# EAGLE design DSP_Shield (EAGLE 6.2)
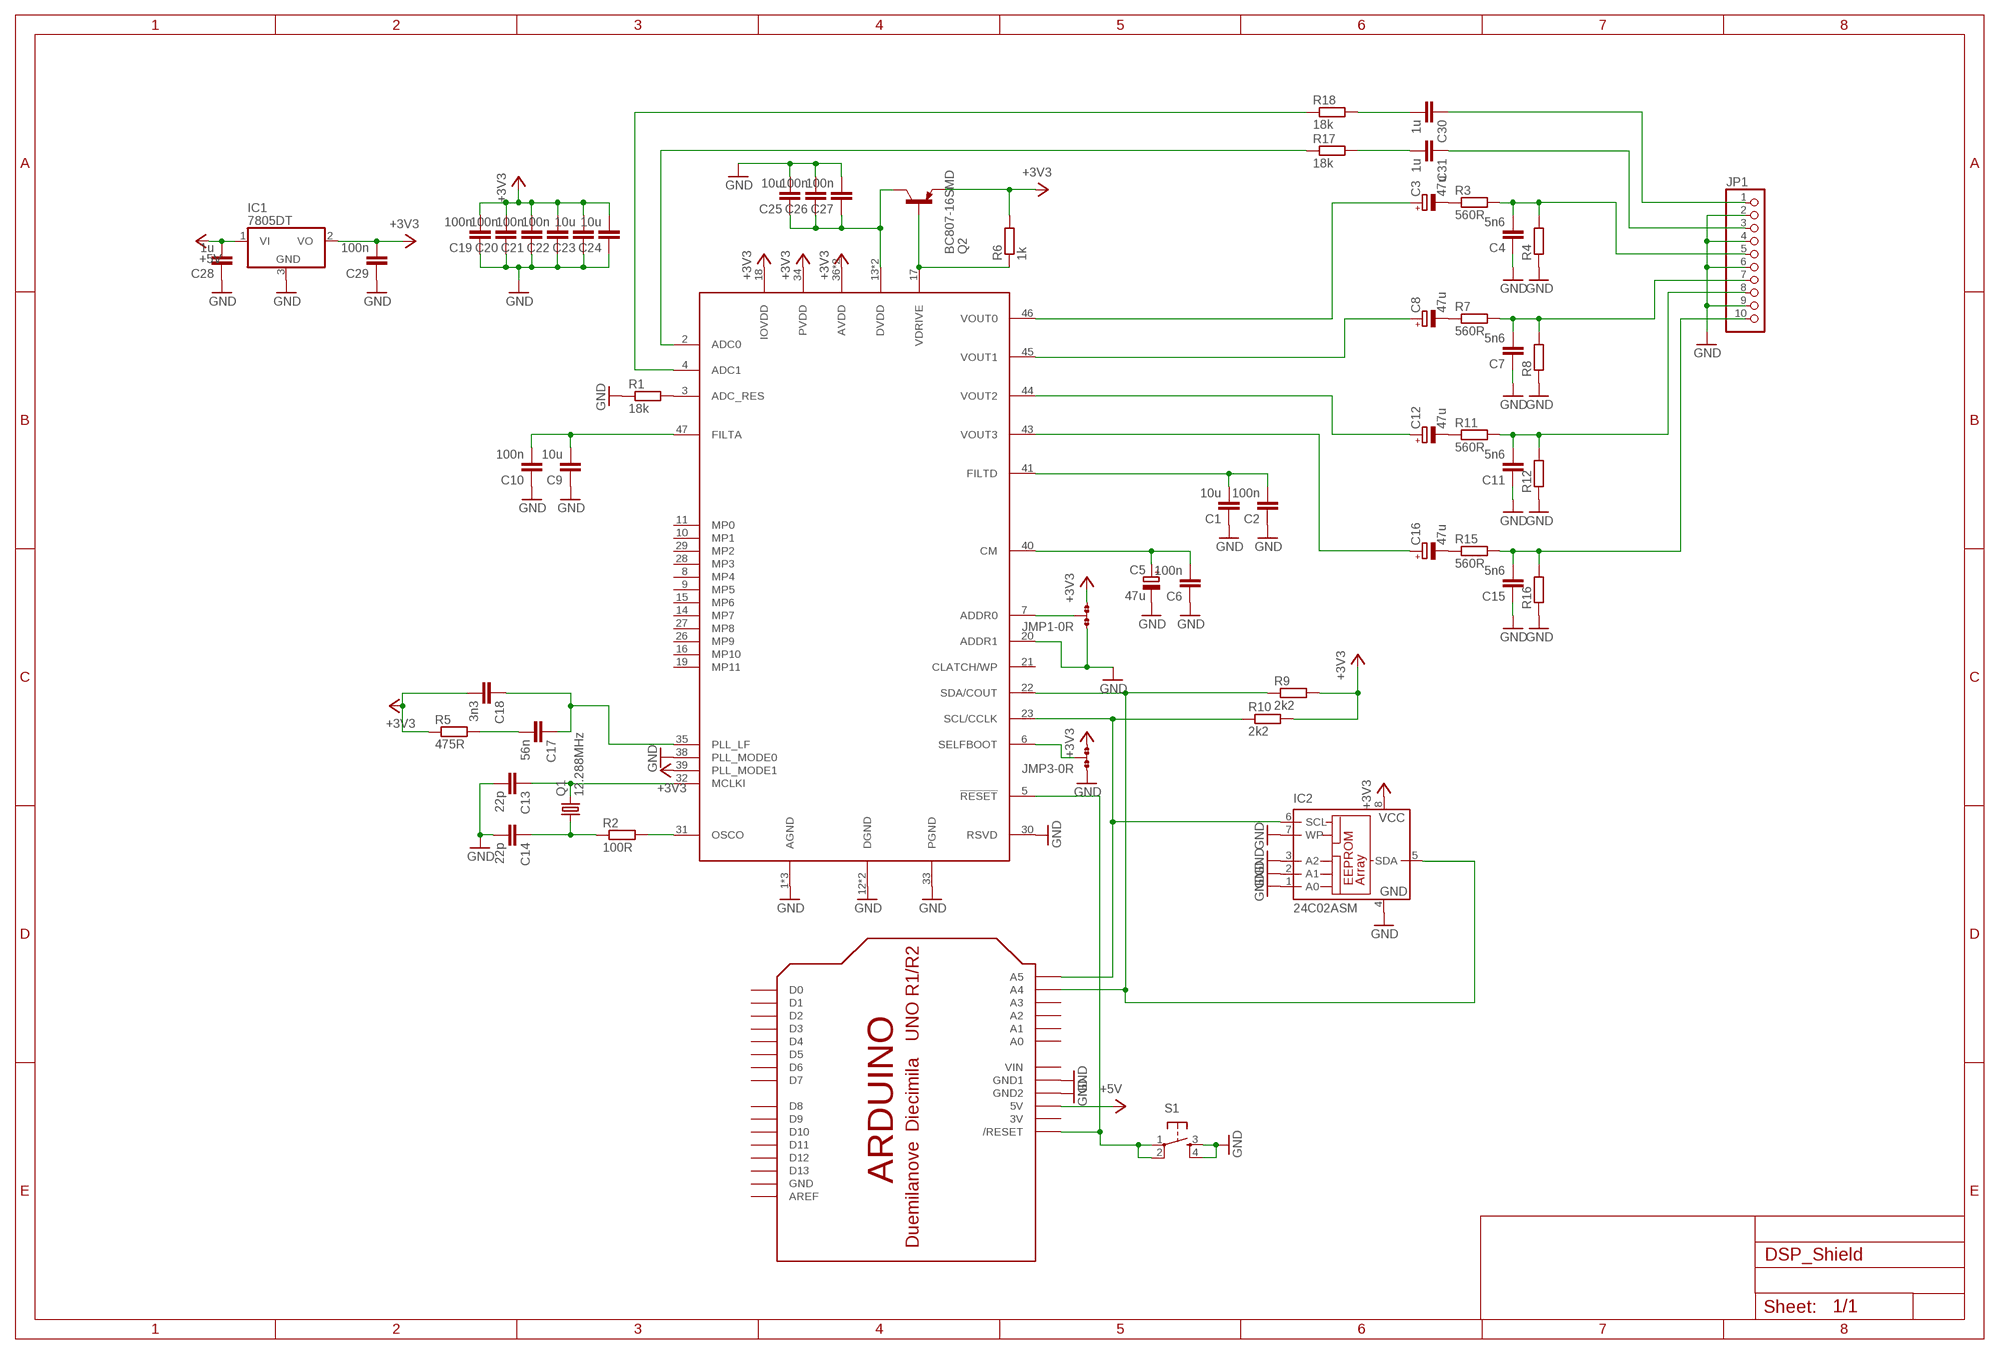
[diagram p0: schematic, sheet 1]

## Parts
C1  10u  C-EUC0805  [C0805]
C2  100n  C-EUC0805  [C0805]
C3  47u  CPOL-EUD  [PANASONIC_D]
C4  5n6  C-EUC0805  [C0805]
C5  47u  CPOL-EUB  [PANASONIC_B]
C6  100n  C-EUC0805  [C0805]
C7  5n6  C-EUC0805  [C0805]
C8  47u  CPOL-EUD  [PANASONIC_D]
C9  10u  C-EUC0805  [C0805]
C10  100n  C-EUC0805  [C0805]
C11  5n6  C-EUC0805  [C0805]
C12  47u  CPOL-EUD  [PANASONIC_D]
C13  22p  C-EUC0805  [C0805]
C14  22p  C-EUC0805  [C0805]
C15  5n6  C-EUC0805  [C0805]
C16  47u  CPOL-EUD  [PANASONIC_D]
C17  56n  C-EUC0805  [C0805]
C18  3n3  C-EUC0805  [C0805]
C19  100n  C-EUC0805  [C0805]
C20  100n  C-EUC0805  [C0805]
C21  100n  C-EUC0805  [C0805]
C22  100n  C-EUC0805  [C0805]
C23  10u  C-EUC0805  [C0805]
C24  10u  C-EUC0805  [C0805]
C25  10u  C-EUC0805  [C0805]
C26  100n  C-EUC0805  [C0805]
C27  100n  C-EUC0805  [C0805]
C28  1u  C-EUC0805  [C0805]
C29  100n  C-EUC0805  [C0805]
C30  1u  C-EUC0805  [C0805]
C31  1u  C-EUC0805  [C0805]
IC1  7805DT  [TO252]
IC2  24C02ASM  [SO-08M]
JMP1  0R-JUMPA  [A0R-JMP]
JMP3  0R-JUMPA  [A0R-JMP]
JP1  PINHD-1X10/90  [1X10/90]
Q1  12.288MHz  CRYSTALHC49UP  [HC49UP]
Q2  BC807-16SMD  [SOT23-BEC]
R1  18k  R-EU_R0805  [R0805]
R2  100R  R-EU_R0805  [R0805]
R3  560R  R-EU_R0805  [R0805]
R4  R-EU_R0805  [R0805]
R5  475R  R-EU_R0805  [R0805]
R6  1k  R-EU_R0805  [R0805]
R7  560R  R-EU_R0805  [R0805]
R8  R-EU_R0805  [R0805]
R9  2k2  R-EU_R0805  [R0805]
R10  2k2  R-EU_R0805  [R0805]
R11  560R  R-EU_R0805  [R0805]
R12  R-EU_R0805  [R0805]
R15  560R  R-EU_R0805  [R0805]
R16  R-EU_R0805  [R0805]
R17  18k  R-EU_R0805  [R0805]
R18  18k  R-EU_R0805  [R0805]
S1  TAC_SWITCHSMD  [TACTILE_SWITCH_SMD]
U$1  ARDUINO-NODIM  [ARDUINO-NODIM]
U$2  ADAU1701  [TQFP48]

## Nets
+3V3: C18.2 C19.2 C20.2 C21.2 C22.2 C23.2 C24.2 C29.2 IC1.2(VO) IC2.8(VCC) JMP1.3 JMP3.3 Q2.E R5.1 R6.2 R9.2 R10.2 U$2.18(IOVDD) U$2.34(PVDD) U$2.36(AVDD) U$2.39(PLL_MODE1) U$2.48(AVDD)
+5V: C28.2 IC1.1(VI) U$1.5V
GND: C1.1 C2.1 C4.1 C5.- C6.1 C7.1 C9.1 C10.1 C11.1 C13.2 C14.2 C15.1 C19.1 C20.1 C21.1 C22.1 C23.1 C24.1 C25.2 C26.2 C27.2 C28.1 C29.1 IC1.3(GND) IC2.1(A0) IC2.2(A1) IC2.3(A2) IC2.4(GND) IC2.7(WP) JMP1.1 JMP3.1 JP1.2 JP1.4 JP1.6 JP1.9 R1.1 R4.1 R8.1 R12.1 R16.1 S1.3 S1.4 U$1.GND1 U$1.GND2 U$2.1(AGND) U$2.12(DGND) U$2.20(ADDR1) U$2.25(DGND) U$2.30(RSVD) U$2.33(PGND) U$2.37(AGND) U$2.38(PLL_MODE0) U$2.42(AGND)
N$1: R2.2 U$2.31(OSCO)
N$2: R1.2 U$2.3(ADC_RES)
N$3: C1.2 C2.2 U$2.41(FILTD)
N$4: C3.- R3.1
N$5: C4.2 JP1.5 R3.2 R4.2
N$6: C14.1 Q1.1 R2.1
N$7: C5.+ C6.2 U$2.40(CM)
N$8: C9.2 C10.2 U$2.47(FILTA)
N$9: C8.- R7.1
N$10: C7.2 JP1.7 R7.2 R8.2
N$11: C13.1 Q1.2 U$2.32(MCLKI)
N$12: R18.1 U$2.4(ADC1)
N$13: C17.2 R5.2
N$14: C12.- R11.1
N$15: C11.2 JP1.8 R11.2 R12.2
N$16: C16.+ U$2.43(VOUT3)
N$17: C17.1 C18.1 U$2.35(PLL_LF)
N$18: JMP1.2 U$2.7(ADDR0)
N$19: C16.- R15.1
N$20: C15.2 JP1.10 R15.2 R16.2
N$21: IC2.6(SCL) R10.1 U$1.A5 U$2.23(SCL/CCLK)
N$22: IC2.5(SDA) R9.1 U$1.A4 U$2.22(SDA/COUT)
N$23: C12.+ U$2.44(VOUT2)
N$24: C8.+ U$2.45(VOUT1)
N$25: C3.+ U$2.46(VOUT0)
N$26: S1.1 S1.2 U$1.RESET(/RESET) U$2.5(!RESET)
N$27: C31.1 JP1.3
N$28: C30.1 JP1.1
N$29: R17.1 U$2.2(ADC0)
N$30: C31.2 R17.2
N$31: C25.1 C26.1 C27.1 Q2.C U$2.13(DVDD) U$2.24(DVDD)
N$32: Q2.B R6.1 U$2.17(VDRIVE)
N$33: C30.2 R18.2
N$37: JMP3.2 U$2.6(SELFBOOT)
Unconnected: U$1.A0 U$1.A1 U$1.A2 U$1.A3 U$1.AREF U$1.D0 U$1.D1 U$1.D2 U$1.D3 U$1.D4 U$1.D5 U$1.D6 U$1.D7 U$1.D8 U$1.D9 U$1.D10 U$1.D11 U$1.D12 U$1.D13 U$2.8(MP4) U$2.9(MP5) U$2.10(MP1) U$2.11(MP0) U$2.14(MP7) U$2.15(MP6) U$2.16(MP10) U$2.19(MP11) U$2.21(CLATCH/WP) U$2.26(MP9) U$2.27(MP8) U$2.28(MP3) U$2.29(MP2)

## Power pins joined to a net without a drawn wire
3V: U$1.3V
GND: U$1.GND
VIN: U$1.VIN

## Library data of the parts
C1 C2 C4 C6 C7 C9-C11 C13-C15 C17-C31 = rcl:C-EU: CAPACITOR, European symbol
C3 C5 C8 C12 C16 = rcl:CPOL-EU: POLARIZED CAPACITOR, European symbol
IC1 = linear:78*: Positive VOLTAGE REGULATOR Source: http://cache.national.com/ds/LM/LM78L05.pdf http://www.fairchildsemi.com/ds/LM/LM7805.pdf
IC2 = microchip:24*: Serial EEPROM I2C; MF: MICROCHIP; MPN: 24C02C/SN; OC_FARNELL: 1084339; OC_NEWARK: 96K4065
JMP1 JMP3 = jump-0r-smd:0R-JUMP: SMD 0R 0805 Jumper
JP1 = pinhead:PINHD-1X10: PIN HEADER
Q1 = crystal:CRYSTAL: CRYSTAL; OC_FARNELL: unknown; OC_NEWARK: unknown
Q2 = transistor-pnp:BC807*: PNP Transistror
R1-R12 R15-R18 = rcl:R-EU_: RESISTOR, European symbol
S1 = SparkFun:TAC_SWITCH: Momentary Switch Button commonly used for reset or general input. Spark Fun Electronics SKU : COM-00097
U$1 = adafruit:ARDUINO: Arduino Diecimila/Duemilanove Make a shield with ease, this package has all the named pins as well as the two mounting drill holes and an outline of the USB and DC power connector. The outline is on the DIMENSION layer, so if your board house uses it they will cut the outline to match. http://www.ladyada.net/library/pcb/eaglelibrary.html
U$2 = adau1701:ADAU1701

## Board
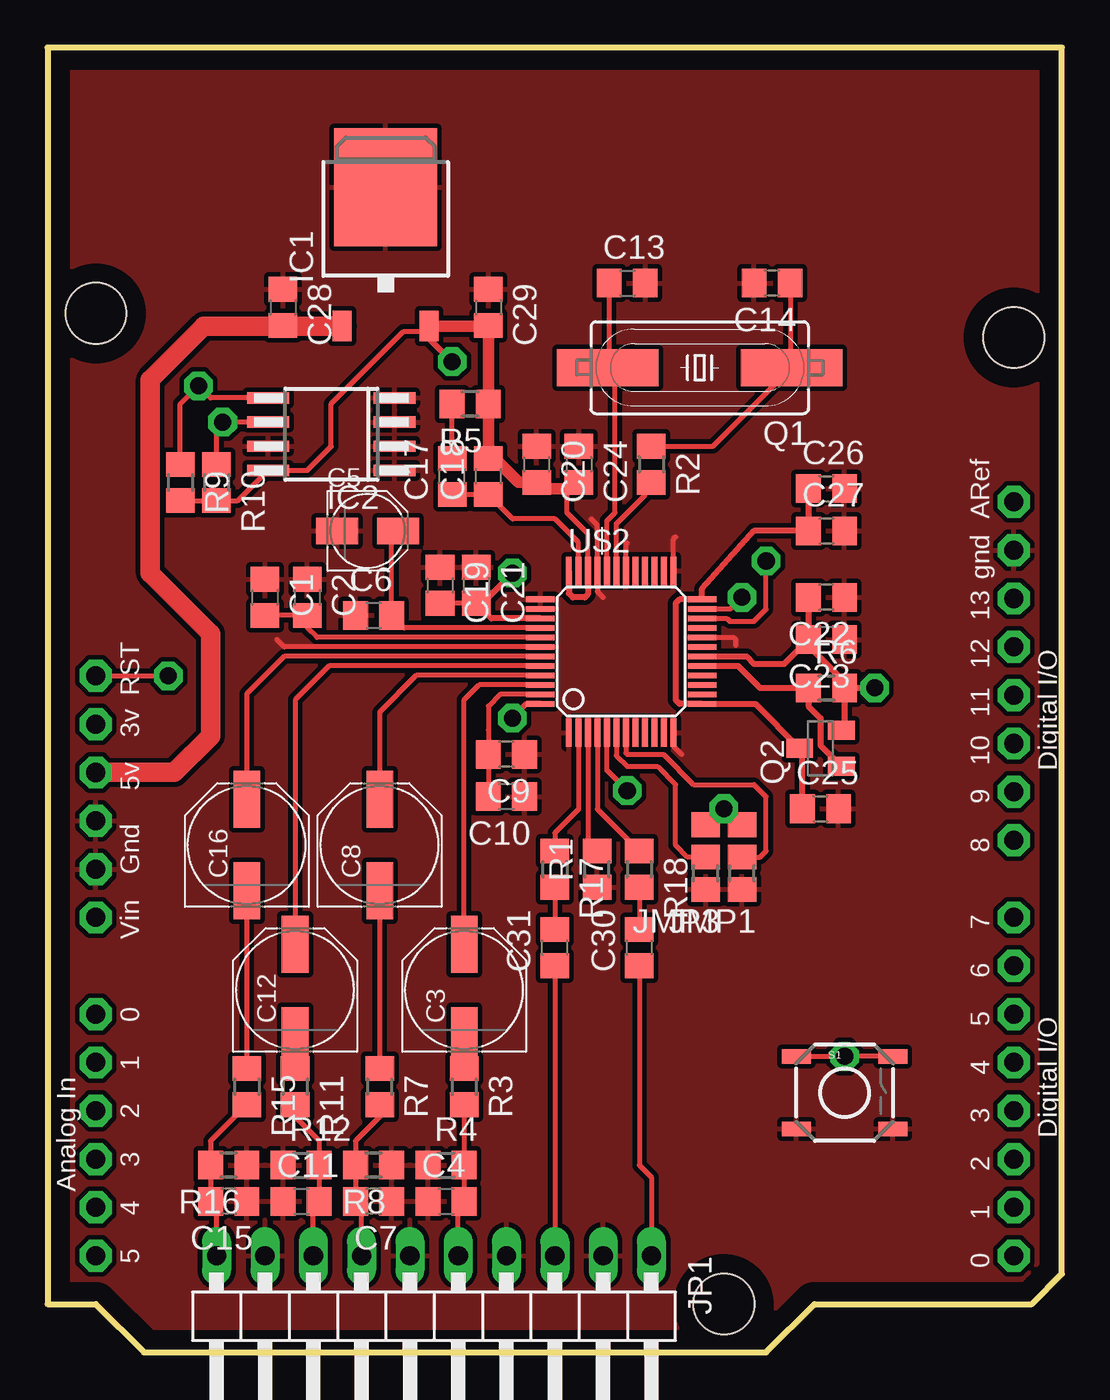
[diagram p1: board, top side]
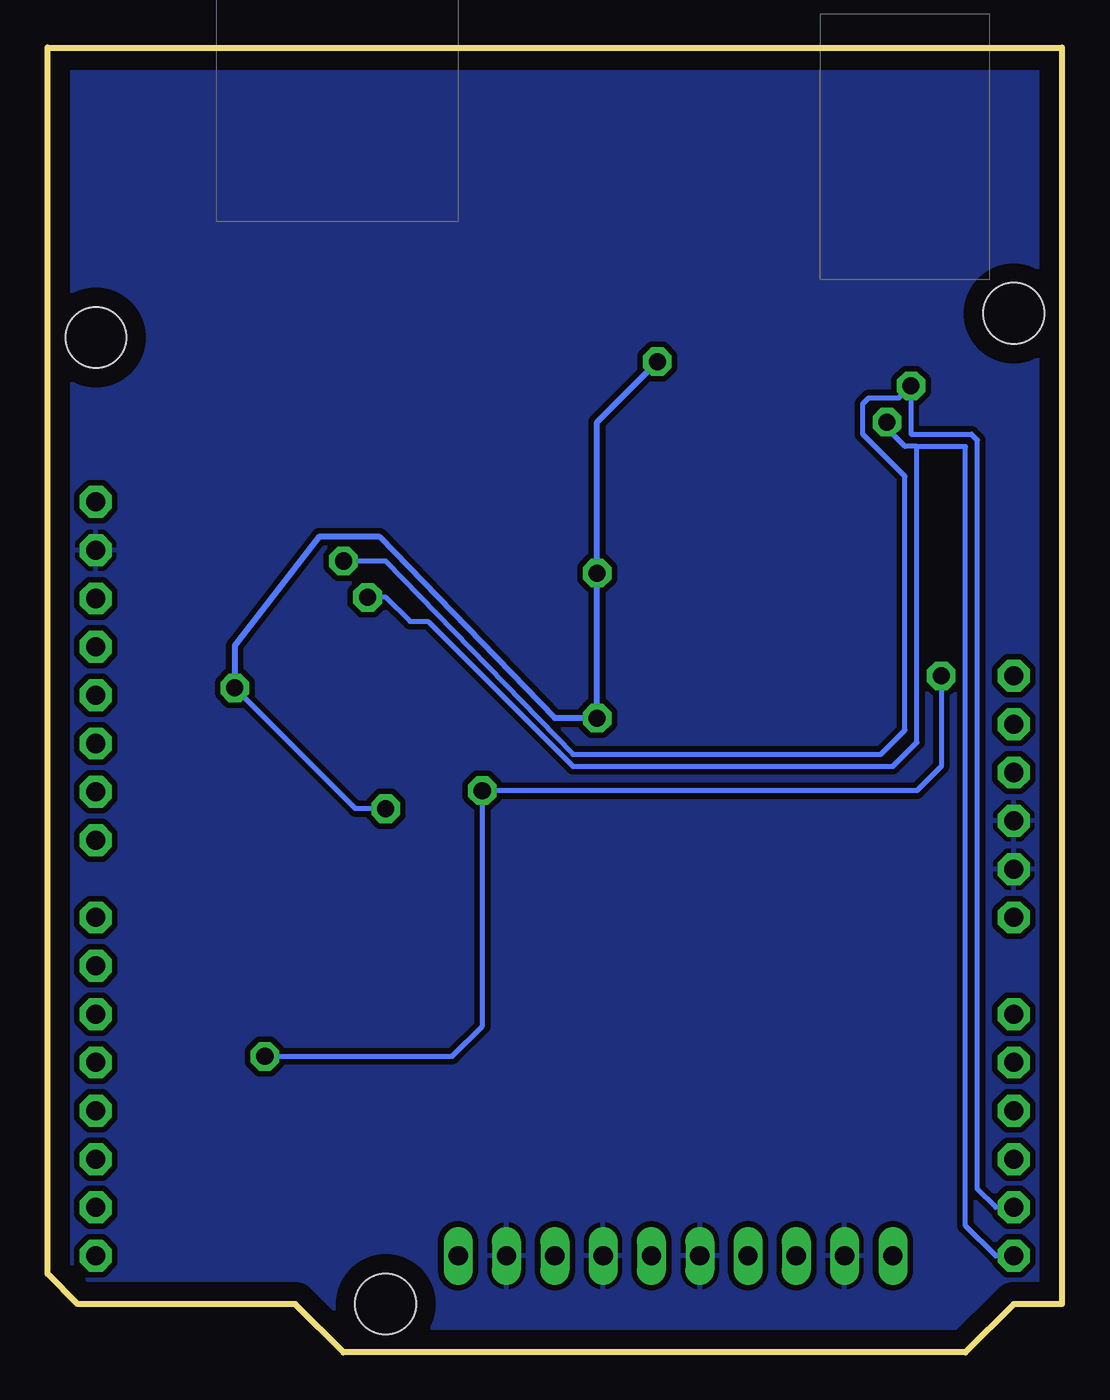
[diagram p2: board, bottom side, seen from below]

Size 53.34 x 68.58 mm. Coordinates in mm from the lower left corner, seen from the top.
Outline: 0,68.58 0,2.54 2.54,2.54 5.08,0 37.78,0 40.32,2.54 51.75,2.54 53.34,4.13 53.34,68.58 0,68.58
Copper layers (1*16): Top 0.035mm / dielectric 1.5mm / Bottom 0.035mm
Design rules: minimum track width 8mil, minimum drill 0.8mm, track to track 7mil, track to pad 7mil, pad to pad 7mil, via to via 21mil, smd to smd 0mil, copper to edge 40mil, drill to drill 8mil, minimum pad ring 10mil, minimum via ring 8mil, stop-mask expansion 4mil, vias tented up to drill 0mil, thermal gap 10mil

### Footprints (pad centres in the part's own frame; a part is rotated, then mirrored left to right if it is on the bottom)
C0805 = smd 1.3 x 1.5: 1 -0.95,0; 2 0.95,0
PANASONIC_D = smd 3 x 1.4: + 2.4,0; - -2.4,0
PANASONIC_B = smd 2.2 x 1.4: + 1.6,0; - -1.6,0
TO252 = smd 1 x 1.6: 1 -2.28,-4.8; 2 2.28,-4.8 | smd 5.4 x 6.2: 3 0,2.5
SO-08M = smd 0.6 x 2.2: 1 -1.905,-3.33; 2 -0.635,-3.33; 3 0.635,-3.33; 4 1.905,-3.33; 5 1.905,3.33; 6 0.635,3.33; 7 -0.635,3.33; 8 -1.905,3.33
A0R-JMP = smd 1.5 x 1.3: 1 0,1.7; 2 0,0; 3 0,-1.7
1X10/90 = drill 1.016 long: 1 -11.43,-3.81; 2 -8.89,-3.81; 3 -6.35,-3.81; 4 -3.81,-3.81; 5 -1.27,-3.81; 6 1.27,-3.81; 7 3.81,-3.81; 8 6.35,-3.81; 9 8.89,-3.81; 10 11.43,-3.81
HC49UP = smd 5.334 x 1.93: 1 -4.826,0; 2 4.826,0
SOT23-BEC = smd 1 x 1.4: B -0.95,-1.1; C 0,1.1; E 0.95,-1.1
R0805 = smd 1.3 x 1.5: 1 -0.95,0; 2 0.95,0
TACTILE_SWITCH_SMD = smd 1.524 x 0.762: 1 -2.54,1.905; 2 2.54,1.905; 3 -2.54,-1.905; 4 2.54,-1.905
ARDUINO-NODIM = drill 1 pad 1.676 octagon: 3V 35.56,2.54; 5V 38.1,2.54; A0 50.8,2.54; A1 53.34,2.54; A2 55.88,2.54; A3 58.42,2.54; A4 60.96,2.54; A5 63.5,2.54; AREF 23.876,50.8; D0 63.5,50.8; D1 60.96,50.8; D2 58.42,50.8; D3 55.88,50.8; D4 53.34,50.8; D5 50.8,50.8; D6 48.26,50.8; D7 45.72,50.8; D8 41.656,50.8; D9 39.116,50.8; D10 36.576,50.8; D11 34.036,50.8; D12 31.496,50.8; D13 28.956,50.8; GND 26.416,50.8; GND1 43.18,2.54; GND2 40.64,2.54; RESET 33.02,2.54; VIN 45.72,2.54 | hole 3.2: 15.24,50.8; 66.04,35.56; 13.97,2.54
TQFP48 = smd 0.3 x 1.5: 1 -2.75,-4.25; 2 -2.25,-4.25; 3 -1.75,-4.25; 4 -1.25,-4.25; 5 -0.75,-4.25; 6 -0.25,-4.25; 7 0.25,-4.25; 8 0.75,-4.25; 9 1.25,-4.25; 10 1.75,-4.25; 11 2.25,-4.25; 12 2.75,-4.25; 25 2.75,4.25; 26 2.25,4.25; 27 1.75,4.25; 28 1.25,4.25; 29 0.75,4.25; 30 0.25,4.25; 31 -0.25,4.25; 32 -0.75,4.25; 33 -1.25,4.25; 34 -1.75,4.25; 35 -2.25,4.25; 36 -2.75,4.25 | smd 1.5 x 0.3: 13 4.25,-2.75; 14 4.25,-2.25; 15 4.25,-1.75; 16 4.25,-1.25; 17 4.25,-0.75; 18 4.25,-0.25; 19 4.25,0.25; 20 4.25,0.75; 21 4.25,1.25; 22 4.25,1.75; 23 4.25,2.25; 24 4.25,2.75; 37 -4.25,2.75; 38 -4.25,2.25; 39 -4.25,1.75; 40 -4.25,1.25; 41 -4.25,0.75; 42 -4.25,0.25; 43 -4.25,-0.25; 44 -4.25,-0.75; 45 -4.25,-1.25; 46 -4.25,-1.75; 47 -4.25,-2.25; 48 -4.25,-2.75

### Placement (x,y rotation side)
C1  11.43,39.69 270 top
C2  13.65,39.69 270 top
C3  21.91,19.05 90 top
C4  20.96,7.94 0 top
C5  16.83,43.18 0 top
C6  17.14,38.73 0 top
C7  17.14,7.94 180 top
C8  17.46,26.67 90 top
C9  24.13,31.43 180 top
C10  24.13,29.21 180 top
C11  13.34,7.94 0 top
C12  13.02,19.05 90 top
C13  30.48,56.2 0 top
C14  38.1,56.2 180 top
C15  9.53,7.94 180 top
C16  10.48,26.67 90 top
C17  21.27,46.04 90 top
C18  23.18,46.04 90 top
C19  20.64,40.32 270 top
C20  25.72,46.67 270 top
C21  22.54,40.32 270 top
C22  40.96,39.69 180 top
C23  40.96,37.47 180 top
C24  27.94,46.67 270 top
C25  40.64,28.57 0 top
C26  40.96,45.4 0 top
C27  40.96,43.18 0 top
C28  12.38,54.93 270 top
C29  23.18,54.93 270 top
C30  31.12,21.27 90 top
C31  26.67,21.27 90 top
IC1  17.78,58.74 0 top
IC2  14.92,48.26 90 top
JMP1  36.51,26.04 180 top
JMP3  34.61,26.04 180 top
JP1  20.32,1.27 180 top
Q1  34.29,51.75 180 top
Q2  40.64,31.75 90 top
R1  28.89,25.4 90 top
R2  31.75,46.67 270 top
R3  21.91,13.97 270 top
R4  20.96,9.84 0 top
R5  22.23,49.85 180 top
R6  40.96,34.92 0 top
R7  17.46,13.97 270 top
R8  17.14,9.84 180 top
R9  6.99,45.72 270 top
R10  8.89,45.72 270 top
R11  13.02,13.97 270 top
R12  13.34,9.84 0 top
R15  10.48,13.97 270 top
R16  9.53,9.84 180 top
R17  26.67,25.4 270 top
R18  31.12,25.4 270 top
S1  41.91,13.65 0 top
U$1  0,68.58 270 top
U$2  30.16,36.83 0 top

### Tracks (layer width: path | path; a pad name or v marks a point on that pad's centre or on a via)
+3V3  (via drill 0.9 pad 1.5)
  Top 0.254: U$2.39 23.34,38.58 C21.2 C19.2 | R5.1 | IC1.2 19.78,53.66 18.73,53.66 14.92,49.85 14.92,47.62 13.65,46.35 IC2.8 10.01,44.77 R10.2 R9.2 | 23.14,53.94 C29.2 | U$2.34 28.41,43.02 27.3,44.13 27.3,45.41 27.62,45.72 C24.2 | 25.08,46.04 25.72,46.04 C20.2 | JMP3.3 34.72,27.73 v35.56,28.57 36.4,27.73 JMP1.3
  Top 0.305: C22.2 C23.2 | C23.2 40.01,37.14 41.59,35.56 41.59,35.24 R6.2 | R6.2 41.91,32.87 Q2.E | U$2.36 27.41,39.9 27.62,39.69 28.26,39.69 28.41,39.85 U$2.34 | U$2.48 25.19,34.08 v24.45,33.34 | U$2.39 23.33,38.58 C21.2 22.86,39.37 v24.45,40.96 | v21.27,52.07 20,53.34 20,53.88 IC1.2 | U$2.18 36.76,36.58 37.15,36.2 38.74,36.2 C23.2 | R6.2 v43.5,34.92
  Top 0.61: IC1.2 23.18,53.94 C29.2 R5.1 | R5.1 23.18,47.62 C18.2 23.5,46.99 24.76,45.72 C20.2 25.72,45.41 25.71,45.41 27.3,45.41
  Bottom 0.254: v35.56,28.57 37.15,28.57 v43.5,34.92
  Bottom 0.305: v21.27,52.07 24.45,48.89 v24.45,40.96 v24.45,33.34 26.67,33.34 35.88,42.86 39.05,42.86 43.5,37.15 v43.5,34.92
+5V
  Top 0.305: 12.34,53.94 C28.2
  Top 1.016: U$1.5V 6.67,30.48 8.57,32.38 8.57,37.78 5.4,40.96 5.4,51.12 8.22,53.94 12.34,53.94 IC1.1
GND
  Top 0.254: U$2.42 12.45,37.08 12.07,37.47 | U$2.12 32.91,31.86 33.34,31.43 | U$2.30 30.41,42.48 30.48,42.55 | 29.21,39.69 28.91,39.98 U$2.33 28.91,43.48 28.57,43.81 | U$2.25 32.91,42.75 33.02,42.86 | U$2.20 36.08,37.58 36.2,37.47 36.2,37.15
  pour Top (isolate 0.254): 70.8,95.25 70.8,-22.54 -11.11,-22.54 -11.11,95.25
  pour Bottom (isolate 0.305): -36.51,103.19 108.27,103.19 108.27,-40.01 -36.51,-40.01
N$1
  Top 0.254: U$2.31 29.91,43.56 31.43,45.09 31.43,45.41 R2.2
N$2
  Top 0.254: U$2.3 28.41,26.83 R1.2
N$3
  Top 0.254: U$2.41 14.17,37.58 13.65,38.1 C2.2 C1.2
N$4
  Top 0.254: R3.1 C3.-
N$5
  Top 0.254: R3.2 R4.2 C4.2 21.59,7.62 JP1.5
N$6
  Top 0.254: R2.1 34.99,47.62 Q1.1 39.05,51.82 C14.1
N$7
  Top 0.254: U$2.40 18.76,38.08 C6.2 18.09,42.85 C5.+
N$8
  Top 0.254: U$2.47 23.79,34.58 23.18,33.97 23.18,32.7 C9.2 C10.2
N$9
  Top 0.254: C8.- R7.1
N$10
  Top 0.254: JP1.7 16.51,7.62 C7.2 R8.2 16.19,11.11 17.46,12.38 R7.2
N$11
  Top 0.254: U$2.32 29.41,43.7 29.84,44.13 29.84,51.37 Q1.2 29.53,51.82 C13.1
N$12
  Top 0.254: U$2.4 28.91,28.55 R18.1
N$13
  Top 0.254: C17.2 R5.2
N$14
  Top 0.254: C12.- R11.1
N$15
  Top 0.254: JP1.8 13.97,7.62 C11.2 R12.2 14.29,11.11 13.02,12.38 R11.2
N$16
  Top 0.254: U$2.43 12.45,36.58 10.48,34.61 C16.+
N$17
  Top 0.254: U$2.35 27.91,42.57 26.67,43.81 24.45,43.81 C18.1 C17.1
N$18
  Top 0.254: JMP1.2 37.47,26.04 37.78,26.35 37.78,29.21 37.15,29.84 33.97,29.84 32.39,31.43 30.48,31.43 30.41,31.5 U$2.7
N$19
  Top 0.254: C16.- R15.1
N$20
  Top 0.254: R16.2 | R16.2 C15.2 8.89,7.62 JP1.10 | R15.2 8.57,11.11 R16.2
N$21  (via drill 0.9 pad 1.5)
  Top 0.254: U$2.23 35.91,39.08 v36.51,39.69 | IC2.6 v9.21,48.89 8.89,48.58 R10.1
  Bottom 0.254: U$1.A5 3.49,5.08 5.08,6.67 5.08,47.62 7.62,47.62 | 7.62,47.62 7.62,32.07 8.89,30.8 25.72,30.8 33.34,38.42 34.29,38.42 35.56,39.69 v36.51,39.69 | 7.62,47.62 8.26,47.62 9.21,48.58 v9.21,48.89
N$22  (via drill 0.9 pad 1.5)
  Top 0.254: IC2.5 8.57,50.16 v7.94,50.8 6.99,49.85 R9.1 | U$2.22 35.72,38.58 35.88,38.42 37.15,38.42 37.78,39.05 v37.78,41.59
  Bottom 0.254: U$1.A4 3.49,7.62 4.45,8.57 4.45,47.94 4.76,48.26 7.94,48.26 v7.94,50.8 8.57,50.16 10.16,50.16 10.48,49.85 10.48,48.26 8.26,46.04 8.26,32.7 9.53,31.43 25.72,31.43 35.56,41.59 v37.78,41.59
N$23
  Top 0.254: U$2.44 14.81,36.08 13.02,34.29 C12.+
N$24
  Top 0.254: U$2.45 19.39,35.58 17.46,33.66 C8.+
N$25
  Top 0.254: C3.+ 21.91,34.29 22.7,35.08 U$2.46
N$26  (via drill 0.9 pad 1.5)
  Top 0.254: U$1.RESET v6.35,35.56 | v30.48,29.53 29.41,30.59 U$2.5 | S1.2 v41.91,15.56 S1.1
  Bottom 0.254: v6.35,35.56 6.35,30.8 7.62,29.53 v30.48,29.53 30.48,17.14 32.07,15.56 v41.91,15.56
N$27
  Top 0.254: C31.1 JP1.3
N$28
  Top 0.254: C30.1 31.12,9.84 31.75,9.21 JP1.1
N$29
  Top 0.254: U$2.2 27.91,28.55 26.67,27.3 R17.1
N$30
  Top 0.254: R17.2 C31.2
N$31
  Top 0.305: C25.1 39.69,31.6 Q2.C 37.21,34.08 U$2.13 33.23,34.08 33.02,34.29 33.02,39.37 33.23,39.58 U$2.24 | U$2.24 34.82,39.58 | C26.1 C27.1 37.15,43.18 34.41,40.13 U$2.24
N$32
  Top 0.305: Q2.B 40.64,31.9 40.64,33.34 40.01,33.97 R6.1 37.47,34.92 36.31,36.08 U$2.17
N$33
  Top 0.254: R18.2 C30.2
N$37
  Top 0.254: JMP3.2 33.66,26.04 33.02,26.67 33.02,29.84 32.07,30.8 30.48,30.8 29.91,31.36 U$2.6